# Altium schematic sheet Micro.SchDoc
size A4
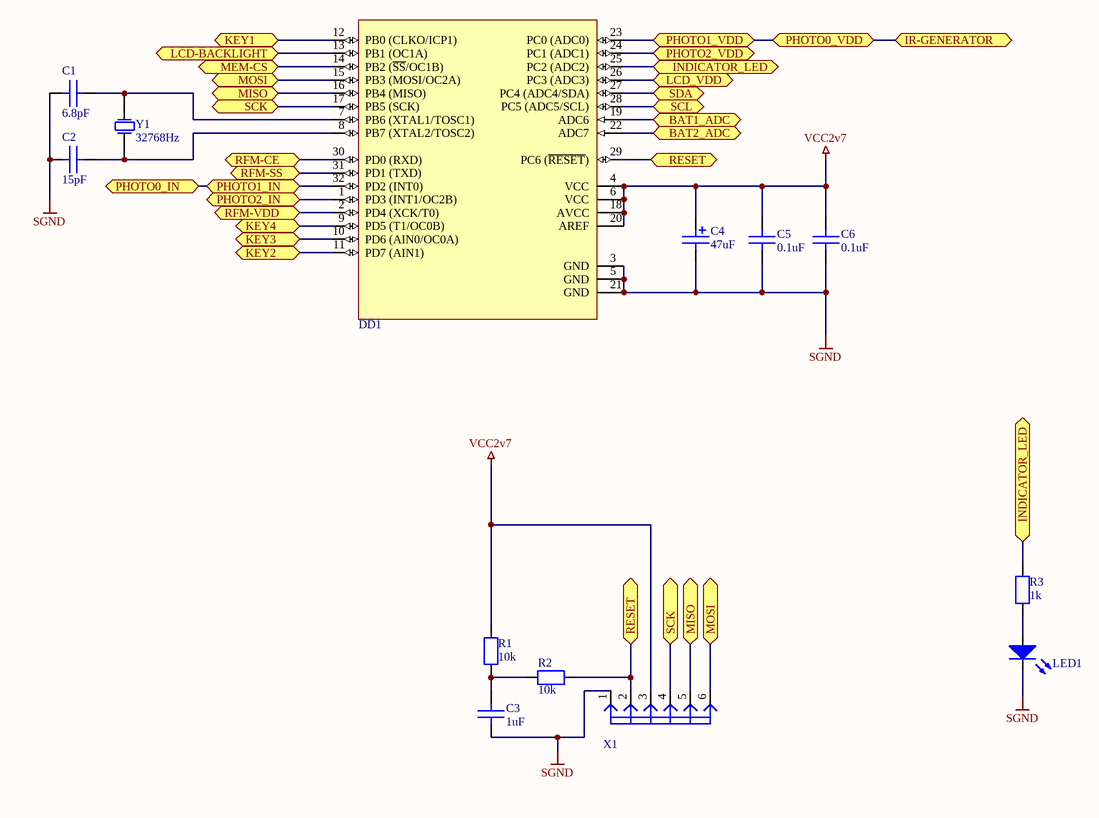
[diagram p0: Micro.SchDoc]

## Parts
C1  value 6.8pF  [C0805]  (hidden comment: C6.8pF-50V-10%)
C2  value 15pF  [C0805]  (hidden comment: C15pF-50V-10%)
C3  value 1uF  [C0805]  (hidden comment: C1uF-50V)
C4  value 47uF  [TC2917]  (hidden comment: C47uF-10V-tant)
C5  value 0.1uF  [C0805]  (hidden comment: C0.1uF-50V)
C6  value 0.1uF  [C0805]  (hidden comment: C0.1uF-50V)
DD1  ATmega328P  [32A_N]  (value not drawn)
LED1  LED-RED  [LED-3]  (value not drawn)
R1  value 10k  [R0805]  (hidden comment: R10k-5%)
R2  value 10k  [R0805]  (hidden comment: R10k-5%)
R3  value 1k  [R0805]  (hidden comment: R1k-5%)
X1  PLS-6  [PLS-6]  (value not drawn)
Y1  value 32768Hz  [KX38]  (hidden comment: XTAL32768Hz)

## Ports
BAT1_ADC, BAT2_ADC, INDICATOR_LED, IR-GENERATOR, KEY1, KEY2, KEY3, KEY4, LCD-BACKLIGHT, LCD_VDD, MEM-CS, MISO, MOSI, PHOTO0_IN, PHOTO0_VDD, PHOTO1_IN, PHOTO1_VDD, PHOTO2_IN, PHOTO2_VDD, RESET, RFM-CE, RFM-SS, RFM-VDD, SCK, SCL, SDA

## Nets
SGND: C1.1 C2.1 C3.1 C4.2 C5.1 C6.1 DD1.3(GND) DD1.5(GND) DD1.21(GND) LED1.2(K) X1.1
VCC2v7: C4.1 C5.2 C6.2 DD1.4(VCC) DD1.6(VCC) DD1.18(AVCC) DD1.20(AREF) R1.2 X1.3
BAT1_ADC: DD1.19(ADC6) ; port BAT1_ADC
BAT2_ADC: DD1.22(ADC7) ; port BAT2_ADC
INDICATOR_LED: DD1.25(PC2_(ADC2)) R3.2 ; port INDICATOR_LED
IR-GENERATOR: DD1.23(PC0_(ADC0)) ; port PHOTO1_VDD, port PHOTO0_VDD, port IR-GENERATOR
KEY1: DD1.12(PB0_(CLKO/ICP1)) ; port KEY1
KEY2: DD1.11(PD7_(AIN1)) ; port KEY2
KEY3: DD1.10(PD6_(AIN0/OC0A)) ; port KEY3
KEY4: DD1.9(PD5_(T1/OC0B)) ; port KEY4
LCD-BACKLIGHT: DD1.13(PB1_(OC1A)) ; port LCD-BACKLIGHT
LCD_VDD: DD1.26(PC3_(ADC3)) ; port LCD_VDD
MEM-CS: DD1.14(PB2_(~{SS}/OC1B)) ; port MEM-CS
MISO: DD1.16(PB4_(MISO)) X1.5 ; port MISO
MOSI: DD1.15(PB3_(MOSI/OC2A)) X1.6 ; port MOSI
PHOTO0_IN: DD1.32(PD2_(INT0)) ; port PHOTO1_IN, port PHOTO0_IN
PHOTO2_IN: DD1.1(PD3_(INT1/OC2B)) ; port PHOTO2_IN
PHOTO2_VDD: DD1.24(PC1_(ADC1)) ; port PHOTO2_VDD
RESET: DD1.29(PC6_(~{RESET})) R2.2 X1.2 ; port RESET
RFM-CE: DD1.30(PD0_(RXD)) ; port RFM-CE
RFM-SS: DD1.31(PD1_(TXD)) ; port RFM-SS
RFM-VDD: DD1.2(PD4_(XCK/T0)) ; port RFM-VDD
SCK: DD1.17(PB5_(SCK)) X1.4 ; port SCK
SCL: DD1.28(PC5_(ADC5/SCL)) ; port SCL
SDA: DD1.27(PC4_(ADC4/SDA)) ; port SDA
NetC1_2: C1.2 DD1.7(PB6_(XTAL1/TOSC1)) Y1.2(OSC2)
NetC2_2: C2.2 DD1.8(PB7_(XTAL2/TOSC2)) Y1.1(OSC1)
NetC3_2: C3.2 R1.1 R2.1
NetLED1_1: LED1.1(A) R3.1

## Library data of the parts
C1 = C6.8pF-50V-10%: Type: Конденсатор керамический; Voltage: 50V; Accuracy: 10%; Name: C6.8pF-50V-10%
C2 = C15pF-50V-10%: Type: Конденсатор керамический; Voltage: 50V; Accuracy: 10%; Name: C15pF-50V-10%
C3 = C1uF-50V: Type: Конденсатор керамический; Voltage: 50V; Name: C1uF-50V
C4 = C47uF-10V-tant: Type: Конденсатор танталовый; Voltage: 10V; Name: C47uF-10V-tant
C5 C6 = C0.1uF-50V: Type: Конденсатор керамический; Voltage: 50V; Name: C0.1uF-50V
DD1 = ATmega328P: 8-Bit AVR Microcontroller with 32K Bytes of In-System Programmable Flash Memory; Name: ATmega328P; Type: Микроконтроллер
LED1 = LED-RED: LED red; Type: Светодиод; Color: Красный; Name: LED-RED
R1 R2 = R10k-5%: R-10k-5%; Precision: 5%; Type: Резистор; Name: R10k-5%
R3 = R1k-5%: R-1k-5%; Precision: 5%; Type: Резистор; Name: R1k-5%
Y1 = XTAL32768Hz: Crystal Oscillator 32768Hz; Name: XTAL32768Hz; Type: Кварц
X1 = PLS-6: Name: PLS-6; Type: Линейка